# Altium project IR Sensor.PrjPcb
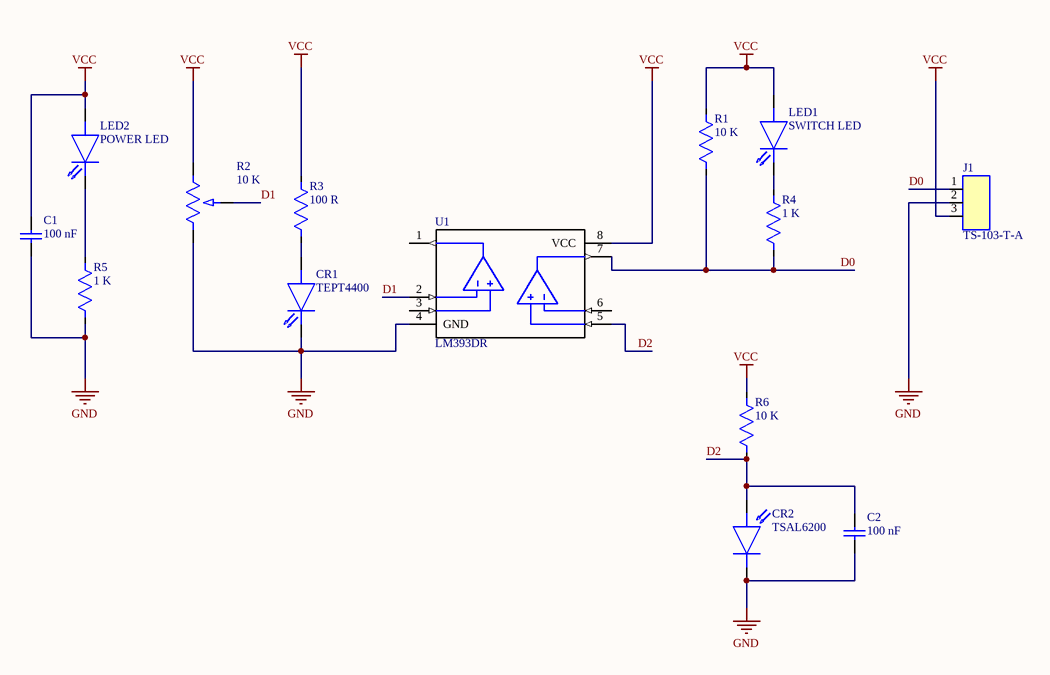
[diagram p0: Sheet1.SchDoc]
1 sheet, 14 parts. Net scope: global (net labels, ports and power ports of the same name join across sheets).
Board file: PCB2.PcbDoc

## Sheet Sheet1.SchDoc
size A; SheetNumber: 1; SheetTotal: 1

### Parts
C1  100 nF  [C0805C104M8RAC7800]
C2  100 nF  [C0805C104M8RAC7800]
CR1  TEPT4400  [TEPT4400]
CR2  TSAL6200  [TSAL6200]
J1  TS-103-T-A  [TS-103-T-A]
LED1  SWITCH LED  [CMD15-21VRD/TR8]
LED2  POWER LED  [CMD15-21VRD/TR8]
R1  10 K  [ERJ-6GEYJ103V]
R2  10 K  [3296W-1-103LF]
R3  100 R  [RC0805N_PAN]
R4  1 K  [RNCF0805TKY1K00]
R5  1 K  [RNCF0805TKY1K00]
R6  10 K  [ERJ-6GEYJ103V]
U1  LM393DR  [LM393DR]

### Nets
GND: C1.1 C2.1 CR1.2 CR2.2 J1.2 R2.3 R5.1 U1.4(GND)
VCC: C1.2 J1.3 LED1.1 LED2.1 R1.2 R2.1 R3.2 R6.2 U1.8(VCC)
D0: J1.1 R1.1 R4.1 U1.7(OUT2)
D1: R2.2 U1.2(1IN-)
D2: C2.2 CR2.1 R6.1 U1.5(2IN+)
NetCR1_1: CR1.1 R3.1
NetLED1_2: LED1.2 R4.2
NetLED2_2: LED2.2 R5.2

Not connected (* = marked no-connect by the designer): U1 1(OUT1) 3(1IN+) 6(2IN-)

### Library data of the parts
C1 C2 = C0805C104M8RACTU: CAP CER 0.1UF 10V X7R 0805; P/N: C0805C104M8RAC7800
CR1 = TEPT4400: Phototransistors 570nm Top View Radial; P/N: TEPT4400
CR2 = TSAL6200: Infrared (IR) Emitter 940nm 1.35V 100mA 40mW/sr @ 100mA 34° Radial, 5mm Dia (T 1 3/4); P/N: TSAL6200
J1 = TS-103-T-A: No Description Available; Mfr_Name: Samtec Inc; RefDes: RefDes; Type: Type
LED1 LED2 = CMD15-21VRDTR8: Red LED Indication - Discrete 1.7V 1206 (3216 Metric); P/N: CMD15-21VRD/TR8
R1 R6 = ERJ-6GEYJ103V: 10 kOhms ±5% 0.125W, 1/8W Chip Resistor 0805 (2012 Metric) Automotive AEC-Q200 Thick Film; P/N: ERJ-6GEYJ103V
R2 = 3296W-1-103LF: 10 kOhms 0.5W, 1/2W PC Pins Through Hole Trimmer Potentiometer Cermet 25.0 Turn Top Adjustment; P/N: 3296W-1-103LF
R3 = ERA-6AEB101V: RES SMD 100 OHM 0.1% 1/8W 0805; P/N: ERA-6AEB101V
R4 R5 = RNCF0805TKY1K00: RES SMD 1K OHM 0.01% 1/8W 0805; P/N: RNCF0805TKY1K00
U1 = LM393DR: IC COMPARATOR 2 DIFF 8SOIC; P/N: LM393DR